# EAGLE schematic C12666-vertical (EAGLE 7.7.0)
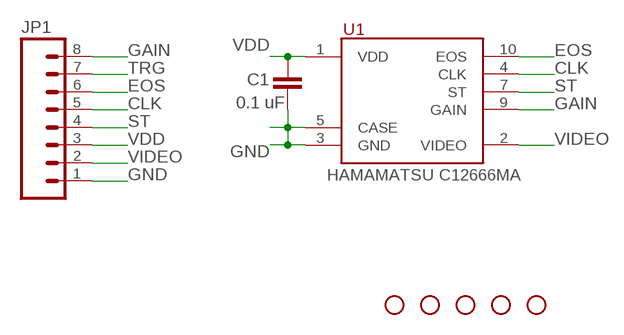
[diagram p0: schematic, sheet 1]

## Parts
C1  0.1 uF  C-EUC0805  [C0805]
JP1  M08SILK_FEMALE_PTH  [1X08]
STANDOFF1  STAND-OFF  [STAND-OFF]
STANDOFF2  STAND-OFF  [STAND-OFF]
STANDOFF3  STAND-OFF  [STAND-OFF]
STANDOFF4  STAND-OFF  [STAND-OFF]
STANDOFF5  STAND-OFF  [STAND-OFF]
U1  MICROSPEC-C12666MA  [C12666MA]

## Nets
CLK: JP1.5 U1.4(CLK)
EOS: JP1.6 U1.10(EOS)
GAIN: JP1.8 U1.9(GAIN)
GND: C1.2 JP1.1 U1.3(GND) U1.5(CASE)
ST: JP1.4 U1.7(ST)
TRG: JP1.7
VDD: C1.1 JP1.3 U1.1(VDD)
VIDEO: JP1.2 U1.2(VIDEO)

## Library data of the parts
C1 = Spectron2:C-EU: CAPACITOR, European symbol
JP1 = Spectron2:M08: Header 8 Standard 8-pin 0.1" header. Use with straight break away headers (SKU : PRT-00116), right angle break away headers (PRT-00553), swiss pins (PRT-00743), machine pins (PRT-00117), and female headers (PRT-00115).; PROD_ID: CONN-08438
STANDOFF1-STANDOFF5 = Spectron2:STAND-OFF: #4 Stand Off This is the mechanical footprint for a #4 phillips button head screw. Use the keepout ring to avoid running the screw head into surrounding components. SKU : PRT-00447
U1 = Spectron:MICROSPEC-C12666MA: Hamamatsu Micro-Spectrometer C12666MA 350-750nm